# EAGLE design usbjtag (EAGLE 6.5.0)
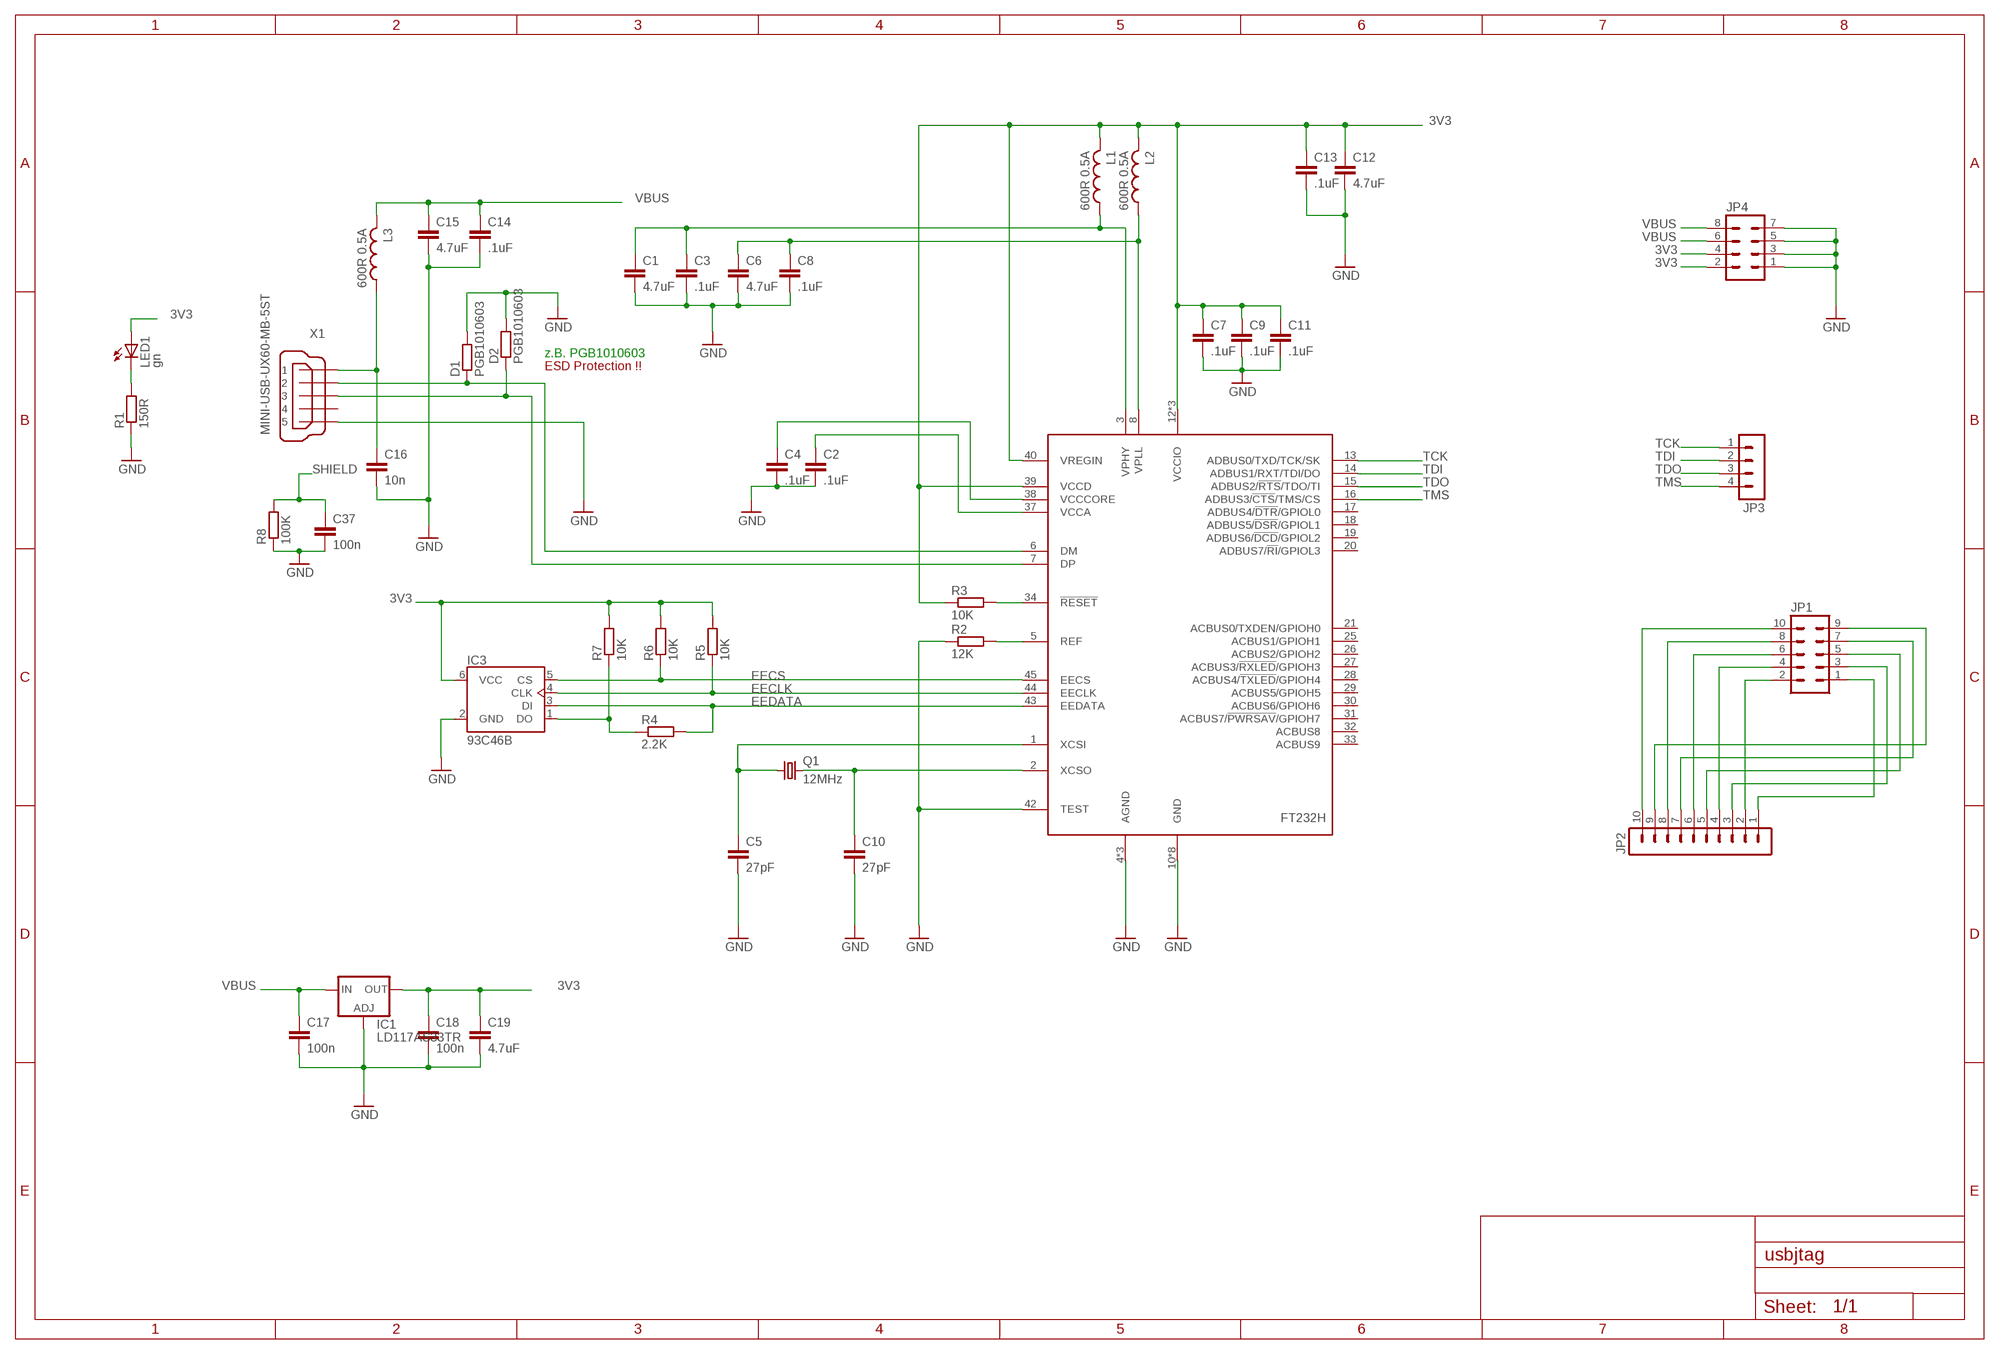
[diagram p0: schematic, sheet 1]

## Parts
C1  4.7uF  C-EUC0805  [C0805]
C2  .1uF  C-EUC0805  [C0805]
C3  .1uF  C-EUC0805  [C0805]
C4  .1uF  C-EUC0805  [C0805]
C5  27pF  C-EUC0805  [C0805]
C6  4.7uF  C-EUC0805  [C0805]
C7  .1uF  C-EUC0805  [C0805]
C8  .1uF  C-EUC0805  [C0805]
C9  .1uF  C-EUC0805  [C0805]
C10  27pF  C-EUC0805  [C0805]
C11  .1uF  C-EUC0805  [C0805]
C12  4.7uF  C-EUC0805  [C0805]
C13  .1uF  C-EUC0805  [C0805]
C14  .1uF  C-EUC0805  [C0805]
C15  4.7uF  C-EUC0805  [C0805]
C16  10n  C-EUC0805  [C0805]
C17  100n  C-EUC0805  [C0805]
C18  100n  C-EUC0805  [C0805]
C19  4.7uF  C-EUC0805  [C0805]
C37  100n  C-EUC0805  [C0805]
D1  PGB1010603  R-EU_R0603  [R0603]
D2  PGB1010603  R-EU_R0603  [R0603]
IC1  LD117AS33TR  [SOT223]
IC2  FT232H  [LQFP48]
IC3  93C46B  DIGITAL-EEPROM-MICROWIRE-6P_SOT23  [SOT23-6]
JP1  MA05-2  [MA05-2]
JP2  MA10-1  [MA10-1]
JP3  MA04-1  [MA04-1]
JP4  MA04-2  [MA04-2]
L1  600R 0.5A  L-USL4532C  [L4532M]
L2  600R 0.5A  L-USL4532C  [L4532M]
L3  600R 0.5A  L-USL4532C  [L4532M]
LED1  gn  LEDCHIPLED_0805  [CHIPLED_0805]
Q1  12MHz  CRYSTAL3.2X2.5  [CRYSTAL3.2X2.5MM]
R1  150R  R-EU_R0805  [R0805]
R2  12K  R-EU_R0805  [R0805]
R3  10K  R-EU_R0805  [R0805]
R4  2.2K  R-EU_R0805  [R0805]
R5  10K  R-EU_R0805  [R0805]
R6  10K  R-EU_R0805  [R0805]
R7  10K  R-EU_R0805  [R0805]
R8  100K  R-EU_R0805  [R0805]
X1  MINI-USB-UX60-MB-5ST  [UX60-MB-5ST]

## Nets
3V3: C7.1 C9.1 C11.1 C12.1 C13.1 C18.1 C19.1 IC1.4(OUT) IC2.12(VCCIO) IC2.24(VCCIO) IC2.39(VCCD) IC2.40(VREGIN) IC2.46(VCCIO) IC3.6(VCC) JP4.2 JP4.4 L1.2 L2.2 LED1.A R3.1 R5.2 R6.2 R7.2
EECLK: IC2.44(EECLK) IC3.4(CLK) R5.1
EECS: IC2.45(EECS) IC3.5(CS) R6.1
EEDATA: IC2.43(EEDATA) IC3.3(DI) R4.2
GND: C1.2 C2.2 C3.2 C4.2 C5.2 C6.2 C7.2 C8.2 C9.2 C10.2 C11.2 C12.2 C13.2 C14.2 C15.2 C16.2 C17.2 C18.2 C19.2 C37.2 D1.2 D2.2 IC1.1(ADJ) IC2.4(AGND) IC2.9(AGND) IC2.10(GND) IC2.11(GND) IC2.22(GND) IC2.23(GND) IC2.35(GND) IC2.36(GND) IC2.41(AGND) IC2.42(TEST) IC2.47(GND) IC2.48(GND) IC3.2(GND) JP4.1 JP4.3 JP4.5 JP4.7 R1.1 R2.1 R8.1 X1.5
N$1: IC3.1(DO) R4.1 R7.1
N$2: IC2.34(!RESET) R3.2
N$3: IC2.5(REF) R2.2
N$4: LED1.C R1.2
N$6: D2.1 IC2.7(DP) X1.3
N$7: C10.1 IC2.2(XCSO) Q1.3
N$8: C5.1 IC2.1(XCSI) Q1.1
N$11: C2.1 IC2.37(VCCA)
N$13: JP1.1 JP2.1
N$14: JP1.2 JP2.2
N$15: JP1.3 JP2.3
N$16: JP1.4 JP2.4
N$17: JP1.5 JP2.5
N$18: JP1.6 JP2.6
N$19: JP1.7 JP2.7
N$20: JP1.8 JP2.8
N$21: JP1.10 JP2.10
N$22: JP1.9 JP2.9
N$24: D1.1 IC2.6(DM) X1.2
SHIELD: C37.1 R8.2
TCK: IC2.13(ADBUS0/TXD/TCK/SK) JP3.1
TDI: IC2.14(ADBUS1/RXT/TDI/DO) JP3.2
TDO: IC2.15(ADBUS2/!RTS!/TDO/TI) JP3.3
TMS: IC2.16(ADBUS3/!CTS!/TMS/CS) JP3.4
VBUS: C14.1 C15.1 C17.1 IC1.3(IN) JP4.6 JP4.8 L3.2
VCORE: C4.1 IC2.38(VCCCORE)
VPHY: C1.1 C3.1 IC2.3(VPHY) L1.1
VPLL: C6.1 C8.1 IC2.8(VPLL) L2.1
VUSB: C16.1 L3.1 X1.1
Unconnected: IC2.17(ADBUS4/!DTR!/GPIOL0) IC2.18(ADBUS5/!DSR!/GPIOL1) IC2.19(ADBUS6/!DCD!/GPIOL2) IC2.20(ADBUS7/!RI!/GPIOL3) IC2.21(ACBUS0/TXDEN/GPIOH0) IC2.25(ACBUS1/GPIOH1) IC2.26(ACBUS2/GPIOH2) IC2.27(ACBUS3/!RXLED!/GPIOH3) IC2.28(ACBUS4/!TXLED!/GPIOH4) IC2.29(ACBUS5/GPIOH5) IC2.30(ACBUS6/GPIOH6) IC2.31(ACBUS7/!PWRSAV!/GPIOH7) IC2.32(ACBUS8) IC2.33(ACBUS9) X1.4

## Notes on the sheet
- z.B. PGB1010603
- ESD Protection !!

## Library data of the parts
C1-C19 C37 = rcl:C-EU: CAPACITOR, European symbol
D1 D2 R1-R8 = resistor:R-EU_: RESISTOR, European symbol
IC1 = v-reg:LD117A?*: Low drop fixed and adjustable positive voltage regulators 1 A Source: http://www.st.com/stonline/products/literature/ds/7194/ld1117axx.pdf
IC2 = n39:FT232H: FT232H/HL http://www.ftdichip.com/Products/ICs/FT232H.htm The FT232H is a single channel USB 2.0 Hi-Speed (480Mb/s) to UART/FIFO IC. It has the capability of being configured in a variety of industry standard serial or parallel interfaces.; REICHELT: FT 232 HL
IC3 = saanlima:DIGITAL-EEPROM-MICROWIRE-6P
JP1 = con-lstb:MA05-2: PIN HEADER; OC_FARNELL: unknown; OC_NEWARK: unknown
JP2 = con-lstb:MA10-1: PIN HEADER; OC_FARNELL: unknown; OC_NEWARK: unknown
JP3 = con-lstb:MA04-1: PIN HEADER; OC_FARNELL: unknown; OC_NEWARK: unknown
JP4 = con-lstb:MA04-2: PIN HEADER; OC_FARNELL: unknown; OC_NEWARK: unknown
L1-L3 = rcl:L-US: INDUCTOR, American symbol
LED1 = led:LED: LED OSRAM: - CHIPLED LG R971, LG N971, LY N971, LG Q971, LY Q971, LO R971, LY R971 LH N974, LH R974 LS Q976, LO Q976, LY Q976 LO Q996 - Hyper CHIPLED LW Q18S LB Q993, LB Q99A, LB R99A - SideLED LS A670, LO A670, LY A670, LG A670, LP A670 LB A673, LV A673, LT A673, LW A673 LH A674 LY A675 LS A676, LA A676, LO A676, LY A676, LW A676 LS A679, LY A679, LG A679 - Hyper Micro SIDELED® LS Y876, LA Y876, LO Y876, LY Y876 LT Y87S - SmartLED LW L88C, LW L88S LB L89C, LB L89S, LG L890 LS L89K, LO L89K, LY L89K LS L896, LA L896, LO L896, LY L896 - TOPLED LS T670, LO T670, LY T670, LG T670, LP T670 LSG T670, LSP T670, LSY T670, LOP T670, LYG T670 LG T671, LOG T671, LSG T671 LB T673, LV T673, LT T673, LW T673 LH T674 LS T676, LA T676, LO T676, LY T676, LB T676, LH T676, LSB T676, LW T676 LB T67C, LV T67C, LT T67C, LS T67K, LO T67K, LY T67K, LW E67C LS E67B, LA E67B, LO E67B, LY E67B, LB E67C, LV E67C, LT E67C LW T67C LS T679, LY T679, LG T679 LS T770, LO T770, LY T770, LG T770, LP T770 LB T773, LV T773, LT T773, LW T773 LH T774 LS E675, LA E675, LY E675, LS T675 LS T776, LA T776, LO T776, LY T776, LB T776 LHGB T686 LT T68C, LB T68C - Hyper Mini TOPLED® LB M676 - Mini TOPLED Santana® LG M470 LS M47K, LO M47K, LY M47K Source: http://www.osram.convergy.de LUXEON: - LUMILED® LXK2-PW12-R00, LXK2-PW12-S00, LXK2-PW14-U00, LXK2-PW14-V00 LXK2-PM12-R00, LXK2-PM12-S00, LXK2-PM14-U00 LXK2-PE12-Q00, LXK2-PE12-R00, LXK2-PE12-S00, LXK2-PE14-T00, LXK2-PE14-U00 LXK2-PB12-K00, LXK2-PB12-L00, LXK2-PB12-M00, LXK2-PB14-N00, LXK2-PB14-P00, LXK2-PB14-Q00 LXK2-PR12-L00, LXK2-PR12-M00, LXK2-PR14-Q00, LXK2-PR14-R00 LXK2-PD12-Q00, LXK2-PD12-R00, LXK2-PD12-S00 LXK2-PH12-R00, LXK2-PH12-S00 LXK2-PL12-P00, LXK2-PL12-Q00, LXK2-PL12-R00 Source: www.luxeon.com KINGBRIGHT: KA-3528ASYC Source: www.kingbright.com
Q1 = saanlima:CRYSTAL: Crystals Various standard crystals.
X1 = con-hirose:MINI-USB-: MINI USB Connector Source: http://www.hirose.co.jp/cataloge_hp/e24000019.pdf; OC_FARNELL: unknown; OC_NEWARK: unknown

## Net classes
1 power: width 0.203 mm

## Board
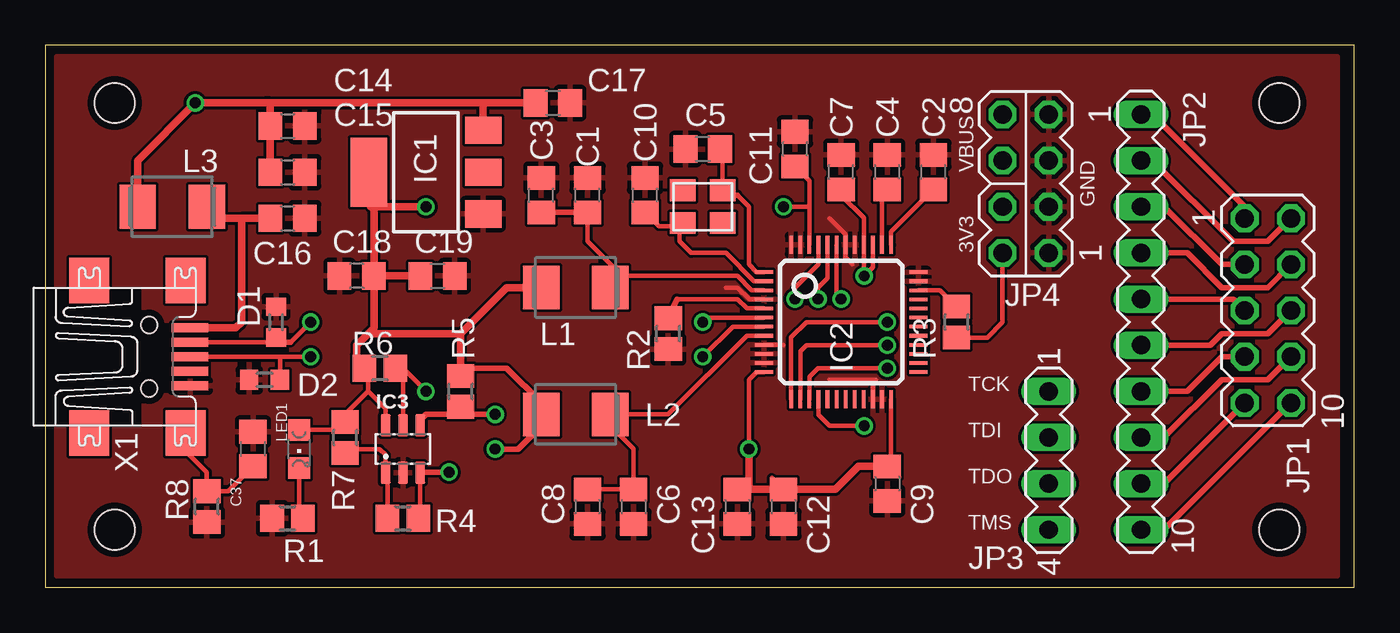
[diagram p1: board, top side]
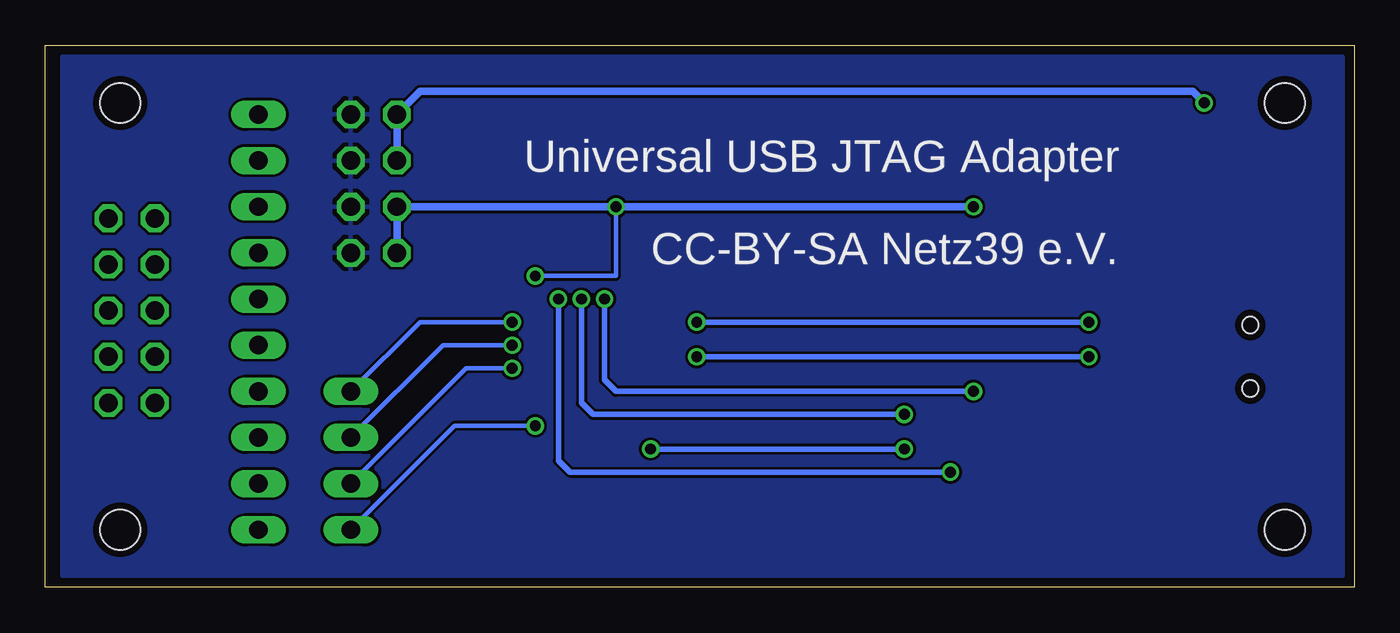
[diagram p2: board, bottom side, seen from below]

Size 72.06 x 29.84 mm. Coordinates in mm from the lower left corner, seen from the top.
Outline: 0,0 72.06,0 72.06,29.84 0,29.84 0,0
Copper layers (1*16): Top 0.0356mm / dielectric 1.5011mm / Bottom 0.0356mm
Design rules "LaenPCBOrder": minimum track width 6mil, minimum drill 13mil, track to track 6mil, track to pad 6mil, pad to pad 6mil, via to via 6mil, smd to smd 6mil, copper to edge 15mil, drill to drill 6mil, minimum pad ring 7mil, minimum via ring 7mil, stop-mask expansion 3mil, vias tented up to drill 0mil, thermal gap 10mil
Holes 2.2 mm at 3.81,3.17 3.81,26.67 67.94,26.67 67.94,3.17

### Footprints (pad centres in the part's own frame; a part is rotated, then mirrored left to right if it is on the bottom)
C0805 = smd 1.3 x 1.5: 1 -0.95,0; 2 0.95,0
R0603 = smd 1 x 1.1: 1 -0.85,0; 2 0.85,0
SOT223 = smd 1.5 x 2: 1 -2.3,-3.15; 2 0,-3.15; 3 2.3,-3.15 | smd 3.8 x 2: 4 0,3.15
LQFP48 = smd 0.2 x 1: 1 -2.75,-4.25; 2 -2.25,-4.25; 3 -1.75,-4.25; 4 -1.25,-4.25; 5 -0.75,-4.25; 6 -0.25,-4.25; 7 0.25,-4.25; 8 0.75,-4.25; 9 1.25,-4.25; 10 1.75,-4.25; 11 2.25,-4.25; 12 2.75,-4.25; 25 2.75,4.25; 26 2.25,4.25; 27 1.75,4.25; 28 1.25,4.25; 29 0.75,4.25; 30 0.25,4.25; 31 -0.25,4.25; 32 -0.75,4.25; 33 -1.25,4.25; 34 -1.75,4.25; 35 -2.25,4.25; 36 -2.75,4.25 | smd 1 x 0.2: 13 4.25,-2.75; 14 4.25,-2.25; 15 4.25,-1.75; 16 4.25,-1.25; 17 4.25,-0.75; 18 4.25,-0.25; 19 4.25,0.25; 20 4.25,0.75; 21 4.25,1.25; 22 4.25,1.75; 23 4.25,2.25; 24 4.25,2.75; 37 -4.25,2.75; 38 -4.25,2.25; 39 -4.25,1.75; 40 -4.25,1.25; 41 -4.25,0.75; 42 -4.25,0.25; 43 -4.25,-0.25; 44 -4.25,-0.75; 45 -4.25,-1.25; 46 -4.25,-1.75; 47 -4.25,-2.25; 48 -4.25,-2.75
SOT23-6 = smd 0.55 x 1.2: 1 -0.95,-1.3; 2 0,-1.3; 3 0.95,-1.3; 4 0.95,1.3; 5 0,1.3; 6 -0.95,1.3
MA05-2 = drill 1.016 octagon: 1 -5.08,-1.27; 2 -5.08,1.27; 3 -2.54,-1.27; 4 -2.54,1.27; 5 0,-1.27; 6 0,1.27; 7 2.54,-1.27; 8 2.54,1.27; 9 5.08,-1.27; 10 5.08,1.27
MA10-1 = drill 1.016 long: 1 -11.43,0; 2 -8.89,0; 3 -6.35,0; 4 -3.81,0; 5 -1.27,0; 6 1.27,0; 7 3.81,0; 8 6.35,0; 9 8.89,0; 10 11.43,0
MA04-1 = drill 1.016 long: 1 -3.81,0; 2 -1.27,0; 3 1.27,0; 4 3.81,0
MA04-2 = drill 1.016 octagon: 1 -3.81,-1.27; 2 -3.81,1.27; 3 -1.27,-1.27; 4 -1.27,1.27; 5 1.27,-1.27; 6 1.27,1.27; 7 3.81,-1.27; 8 3.81,1.27
L4532M = smd 2 x 2.4: 1 -1.9,0; 2 1.9,0
CHIPLED_0805 = smd 1.2 x 1.2: A 0,-1.05; C 0,1.05
CRYSTAL3.2X2.5MM = smd 1.4 x 1.2: 1 -1.1,-0.9; 2 1.1,-0.9; 3 1.1,0.9; 4 -1.1,0.9
R0805 = smd 1.3 x 1.5: 1 -0.85,0; 2 0.85,0
UX60-MB-5ST = smd 2 x 0.5: 1 2.25,1.6; 2 2.25,0.8; 3 2.25,0; 4 2.25,-0.8; 5 2.25,-1.6 | smd 2.2 x 2.5: M1 -3.3,-4.2; M2 -3.3,4.2; M3 2,4.2; M4 2,-4.2 | hole 0.9: 0,-1.75; 0,1.75

### Placement (x,y rotation side)
C1  29.84,21.59 90 top
C2  48.9,22.86 90 top
C3  27.3,21.59 90 top
C4  46.35,22.86 90 top
C5  36.2,24.13 180 top
C6  32.38,4.45 270 top
C7  43.81,22.86 90 top
C8  29.84,4.45 270 top
C9  46.35,5.71 270 top
C10  33.02,21.59 90 top
C11  41.27,24.13 90 top
C12  40.64,4.45 270 top
C13  38.1,4.45 270 top
C14  13.34,25.4 0 top
C15  13.34,22.86 0 top
C16  13.34,20.32 0 top
C17  27.94,26.67 0 top
C18  17.14,17.14 180 top
C19  21.59,17.14 0 top
C37  11.43,7.62 90 top
D1  12.7,14.61 90 top
D2  12.06,11.43 180 top
IC1  20.95,22.86 90 top
IC2  43.81,14.61 270 top
IC3  19.68,7.62 0 top
JP1  67.31,15.24 270 top
JP2  60.33,14.61 270 top
JP3  55.24,6.99 270 top
JP4  53.98,22.23 90 top
L1  29.21,16.51 180 top
L2  29.21,9.53 180 top
L3  6.99,20.95 180 top
LED1  13.97,7.62 180 top
Q1  36.2,20.95 180 top
R1  13.34,3.81 0 top
R2  34.29,13.97 90 top
R3  50.16,14.61 90 top
R4  19.68,3.81 0 top
R5  22.86,10.79 90 top
R6  18.41,12.06 180 top
R7  16.51,8.26 90 top
R8  8.89,4.45 90 top
X1  5.71,12.7 0 top

### Tracks (layer width: path | path; a pad name or v marks a point on that pad's centre or on a via)
3V3  (via drill 0.6)
  Top 0.254: IC2.46 42.06,20.95 | 42.06,20.95 42.06,22.39 C11.1 | C13.1 38.73,5.39 | IC2.12 39.16,11.86 38.73,11.43 v38.73,7.62 | IC2.39 45.56,17.62 v45.09,17.14 45.06,17.16 IC2.40 45.06,20.34 43.81,21.59 C7.1 | v40.64,20.95 42.06,20.95 | R7.2 16.51,9.37 | IC3.6 18.73,9.84 17.78,10.79 | 17.78,10.79 17.78,11.85 R6.2 | R7.2 16.51,9.53 17.78,10.79 | LED1.A 16.07,8.67 R7.2 | 18.09,20.77 17.91,20.95 | 40.01,6.03 C12.1 | IC2.24 46.56,6.67 C9.1 | R3.1 51.85,13.76 52.7,14.61 JP4.2
  Top 0.305: 17.14,12.22 R6.2 | R5.2 23.01,12.06 25.4,12.06 27.31,10.15 L2.2 27.31,8.89 26.04,7.62 v24.77,7.62
  Top 0.406: R5.2 22.86,13.97 | 22.86,13.97 17.78,13.97 | 17.78,13.97 17.14,13.34 17.14,12.22 | L1.2 25.4,16.51 22.86,13.97 | IC1.4 17.91,22.75 17.91,20.95 v20.95,20.95 | C18.1 18.09,20.77 | C18.1 C19.1 | C18.1 18.09,14.29 17.78,13.97 | v38.73,7.62 38.73,5.39 C12.1 43.49,5.39 44.77,6.67 C9.1
  Bottom 0.254: v45.09,17.14 40.64,17.14 v40.64,20.95
  Bottom 0.305: v24.77,7.62 v38.73,7.62
  Bottom 0.406: JP4.2 JP4.4 v40.64,20.95 v20.95,20.95
EECLK  (via drill 0.6)
  Top 0.254: IC2.44 43.06,17.03 42.55,16.51 v42.55,15.88
  Top 0.305: IC3.4 20.64,9.21 20.95,9.53 22.71,9.53 R5.1 23.01,9.53 v24.77,9.53
  Bottom 0.305: v42.55,15.88 42.55,10.16 41.91,9.53 v24.77,9.53
EECS  (via drill 0.6)
  Top 0.254: IC3.5 19.68,11.91 | v41.27,15.88 41.27,16.51 42.56,17.8 IC2.45 | v20.95,10.79 19.68,12.06 R6.1
  Top 0.305: 19.68,11.91 R6.1 19.84,11.91
  Bottom 0.305: v20.95,10.79 40.64,10.79 41.27,11.43 v41.27,15.88
EEDATA  (via drill 0.6)
  Top 0.254: IC2.43 43.56,16.12 v43.81,15.88 | R4.2 20.64,3.81 IC3.3
  Top 0.305: v22.23,6.35 20.66,6.35 IC3.3
  Bottom 0.305: v22.23,6.35 43.18,6.35 43.81,6.99 v43.81,15.88
GND
  Top 0.254: 37.47,16.51 38.1,16.51 38.76,15.86 IC2.4 | 44.45,17.78 44.06,18.16 IC2.42 44.06,19.43 43.18,20.32 | IC2.9 40.62,13.36 40.64,13.34 | IC2.22 45.56,11.28 45.72,11.43 43.18,11.43
  pour Top: 0.64,29.21 71.12,29.21 71.12,0.64 0.64,0.64
  pour Bottom: 0.64,29.21 71.12,29.21 71.12,0.64 0.64,0.64
N$1
  Top 0.254: R4.1 18.84,6.32 IC3.1 18.73,7.3 18.41,7.62 16.73,7.62 R7.1
N$2
  Top 0.254: IC2.34 49.27,16.36 R3.2
N$3
  Top 0.254: IC2.5 38.62,15.36 38.1,15.88 34.77,15.88
  Top 0.305: 34.77,15.88 R2.2
N$4
  Top 0.254: LED1.C 13.97,4.03 R1.2
N$6  (via drill 0.6)
  Top 0.254: IC2.7 37.85,14.36 v36.2,12.7 | X1.3 12.91,12.7 | 12.91,12.7 v14.61,12.7 | D2.1 12.91,12.7
  Bottom 0.305: v36.2,12.7 v14.61,12.7
N$7
  Top 0.254: IC2.2 39.02,16.86 37.47,18.41 35.56,18.41 34.92,19.05 34.92,19.89 33.77,19.89 C10.1
  Top 0.305: 34.92,19.89 Q1.3
N$8
  Top 0.254: IC2.1 39.16,17.36 38.73,17.78 38.73,20.95 38.1,21.59 | Q1.1 37.3,23.83
  Top 0.305: 38.1,21.59 37.56,21.59 Q1.1 | 37.3,23.83 C5.1
N$11
  Top 0.254: IC2.37 46.56,19.58 C2.1
N$13
  Top 0.305: JP2.1 60.96,26.04 66.04,20.95 JP1.1
N$14
  Top 0.305: JP2.2 60.96,23.5 65.41,19.05 67.31,19.05 JP1.2
N$15
  Top 0.305: JP2.3 61.59,20.95 64.77,17.78 JP1.3
N$16
  Top 0.305: JP2.4 62.87,18.41 64.77,16.51 67.31,16.51 JP1.4
N$17
  Top 0.305: JP2.5 65.41,15.88 JP1.5
N$18
  Top 0.305: JP2.6 64.14,13.34 64.77,13.97 67.31,13.97 JP1.6
N$19
  Top 0.305: JP2.7 62.87,10.79 64.77,12.7 JP1.7
N$20
  Top 0.305: JP2.8 61.59,8.26 64.77,11.43 67.31,11.43 JP1.8
N$21
  Top 0.305: JP2.10 61.59,3.17 JP1.10
N$22
  Top 0.305: JP2.9 61.59,5.71 JP1.9
N$24  (via drill 0.6)
  Top 0.254: IC2.6 36.45,14.86 v36.2,14.61 | 13.5,13.5 v14.61,14.61 | X1.2 12.45,13.5 D1.1 12.96,13.5
  Top 0.305: 13.5,13.5 12.96,13.5
  Bottom 0.305: v36.2,14.61 v14.61,14.61
SHIELD
  Top 0.254: C37.1 10.05,5.29 R8.2 8.91,5.84 8.91,5.74 8.89,5.71 8.89,6.35 7.62,7.62
TCK  (via drill 0.6)
  Top 0.254: IC2.13 41.06,13.76 41.91,14.61 v46.35,14.61
  Bottom 0.254: v46.35,14.61 51.44,14.61 JP3.1
TDI  (via drill 0.6)
  Top 0.254: IC2.14 41.56,12.99 41.91,13.34 v46.35,13.34
  Bottom 0.254: v46.35,13.34 50.16,13.34 JP3.2
TDO  (via drill 0.6)
  Top 0.254: IC2.15 42.06,11.59 42.55,12.06 v46.35,12.06
  Bottom 0.254: v46.35,12.06 48.9,12.06 JP3.3
TMS  (via drill 0.6)
  Top 0.254: IC2.16 42.56,9.51 43.18,8.89 v45.09,8.89
  Bottom 0.254: v45.09,8.89 49.53,8.89 JP3.4
VBUS  (via drill 0.6)
  Top 0.406: C15.1 C14.1 12.38,26.67 | 12.38,26.67 24.13,26.67 | 24.13,26.67 C17.1 | IC1.3 24.11,26.64 24.13,26.67 | L3.2 5.08,23.5 v8.26,26.67 12.06,26.67 12.38,26.67
  Bottom 0.406: JP4.6 JP4.8 51.44,27.3 8.89,27.3 v8.26,26.67
VCORE
  Top 0.254: IC2.38 46.06,21.62 C4.1
VPHY
  Top 0.254: IC2.3 38.89,16.36 38.1,17.14 31.75,17.14 29.84,19.05 C1.1
  Top 0.305: 31.27,16.36 L1.1 31.75,17.14 | C1.1 C3.1
VPLL
  Top 0.254: C8.1 C6.1 32.38,7.62 31.11,8.89 L2.1 34.29,9.53 38.62,13.86 IC2.8
VUSB
  Top 0.254: L3.1 9.52,20.32
  Top 0.305: 8.26,20.32 L3.1
  Top 0.406: C16.1 10.79,20.32 | X1.1 10.49,14.3 10.79,14.61 10.79,20.32 | 9.52,20.32 10.79,20.32

### Text on the board
tNames: VBUS | GND | 3V3 | TCK | TDI | TDO | TMS
bNames: Universal USB JTAG Adapter | CC-BY-SA Netz39 e.V.